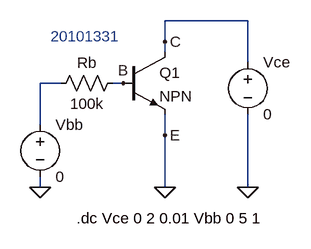
[diagram p0: schematic BJT IV.asc]
BJT IV.asc, the LTspice schematic file:
Version 4
SHEET 1 880 680
WIRE 368 -16 240 -16
WIRE 240 16 240 -16
WIRE 240 32 240 16
WIRE 368 48 368 -16
WIRE 80 80 48 80
WIRE 176 80 160 80
WIRE 48 144 48 80
WIRE 240 160 240 128
WIRE 48 240 48 224
WIRE 240 240 240 160
WIRE 368 240 368 128
FLAG 48 240 0
FLAG 240 240 0
FLAG 368 240 0
FLAG 176 80 B
FLAG 240 160 E
FLAG 240 16 C
SYMBOL voltage 48 128 R0
SYMATTR InstName Vbb
SYMATTR Value 0
SYMBOL res 176 64 R90
WINDOW 0 0 56 VBottom 2
WINDOW 3 32 56 VTop 2
SYMATTR InstName Rb
SYMATTR Value 100k
SYMBOL npn 176 32 R0
SYMATTR InstName Q1
SYMBOL voltage 368 32 R0
SYMATTR InstName Vce
SYMATTR Value 0
TEXT 104 288 Left 2 !.dc Vce 0 2 0.01 Vbb 0 5 1
TEXT 64 8 Left 2 ;20101331

The netlist it stands for:
* BJT IV.asc
Vbb N001 0 0
Rb B N001 100k
Q1 C B 0 0 NPN
Vce C 0 0
.model NPN NPN
.model PNP PNP
.lib standard.bjt
.dc Vce 0 2 0.01 Vbb 0 5 1
* 20101331
.backanno
.end